# EAGLE schematic SWD (EAGLE 7.2.0)
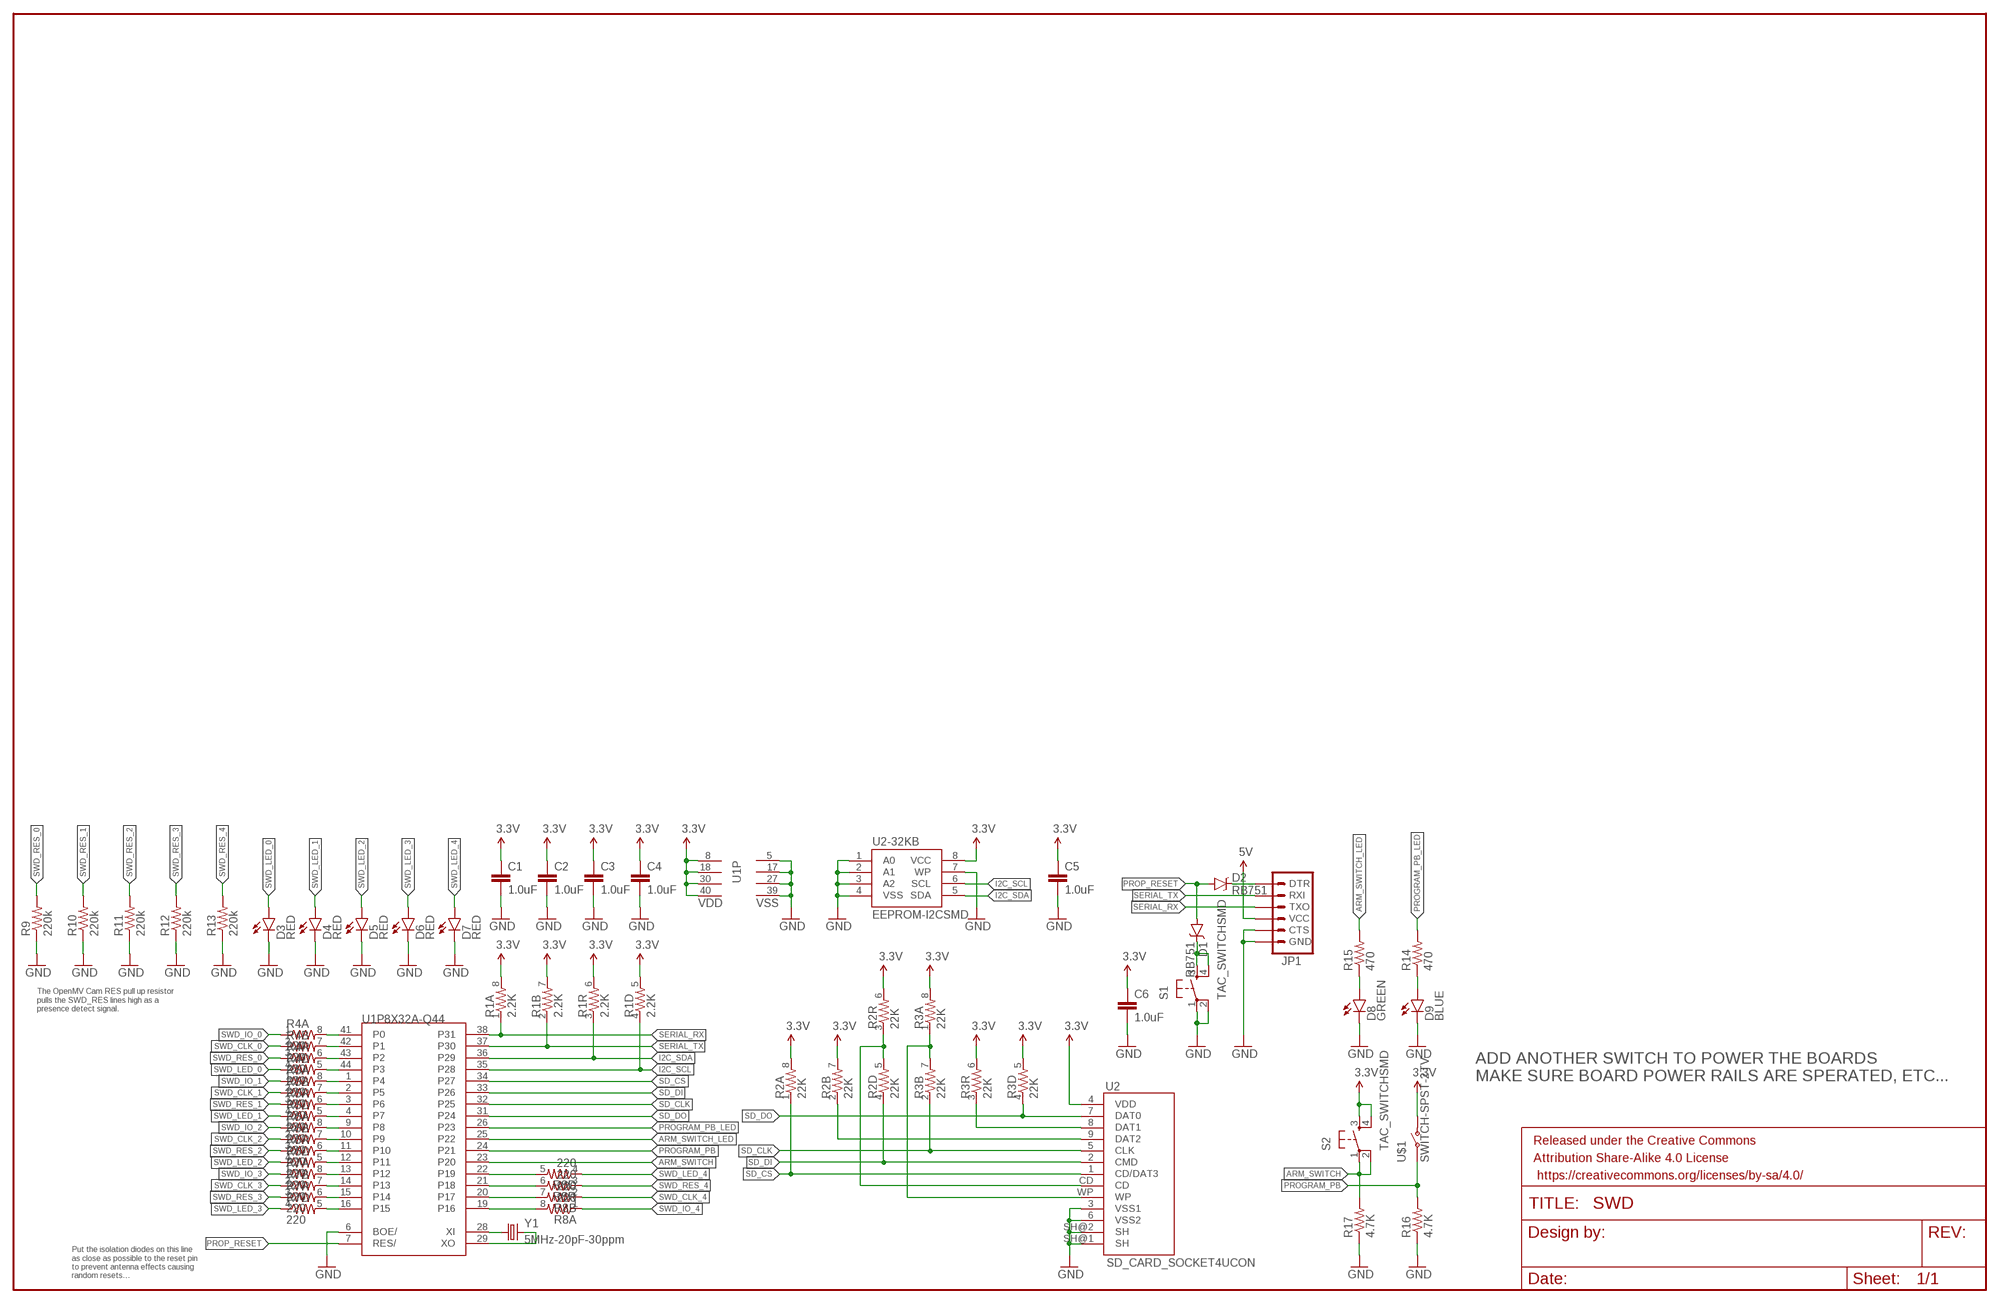
[diagram p0: schematic, sheet 1]

## Parts
C1  1.0uF  1.0UF-16V-10%(0402)  [0402-CAP]
C2  1.0uF  1.0UF-16V-10%(0402)  [0402-CAP]
C3  1.0uF  1.0UF-16V-10%(0402)  [0402-CAP]
C4  1.0uF  1.0UF-16V-10%(0402)  [0402-CAP]
C5  1.0uF  1.0UF-16V-10%(0402)  [0402-CAP]
C6  1.0uF  1.0UF-16V-10%(0402)  [0402-CAP]
D1  RB751  [SOD-523]
D2  RB751  [SOD-523]
D3  RED  LED-RED0603  [LED-0603]
D4  RED  LED-RED0603  [LED-0603]
D5  RED  LED-RED0603  [LED-0603]
D6  RED  LED-RED0603  [LED-0603]
D7  RED  LED-RED0603  [LED-0603]
D8  GREEN  LED-GREEN0603  [LED-0603]
D9  BLUE  LED-BLUE0603  [LED-0603]
FRAME1  FRAME-LEDGER  [CREATIVE_COMMONS]
JP1  ARDUINO_SERIAL_PROGRAMPTH  [1X06]
R1  2.2K  RESISTOR-ARRAY0603-ARV  [0603-ARV]
R2  22K  RESISTOR-ARRAY0603-ARV  [0603-ARV]
R3  22K  RESISTOR-ARRAY0603-ARV  [0603-ARV]
R4  220  RESISTOR-ARRAY0603-ARV  [0603-ARV]
R5  220  RESISTOR-ARRAY0603-ARV  [0603-ARV]
R6  220  RESISTOR-ARRAY0603-ARV  [0603-ARV]
R7  220  RESISTOR-ARRAY0603-ARV  [0603-ARV]
R8  220  RESISTOR-ARRAY0603-ARV  [0603-ARV]
R9  220k  220KOHM1/10W1%(0603)  [0603-RES]
R10  220k  220KOHM1/10W1%(0603)  [0603-RES]
R11  220k  220KOHM1/10W1%(0603)  [0603-RES]
R12  220k  220KOHM1/10W1%(0603)  [0603-RES]
R13  220k  220KOHM1/10W1%(0603)  [0603-RES]
R14  470  470OHM1/10W1%(0603)  [0603-RES]
R15  470  470OHM1/10W1%(0603)  [0603-RES]
R16  4.7K  4.7KOHM-1/10W-1%(0603)  [0603-RES]
R17  4.7K  4.7KOHM-1/10W-1%(0603)  [0603-RES]
S1  TAC_SWITCHSMD  [TACTILE-SWITCH-SMD]
S2  TAC_SWITCHSMD  [TACTILE-SWITCH-SMD]
U1  P8X32A-Q44  [P8X32A-Q44]
U2  SD_CARD_SOCKET4UCON  [SDCARD_4UCONN]
U2-32KB  EEPROM-I2CSMD  [SO08]
U$1  SWITCH-SPST-2TV  [SWITCH-SPST-VERTICAL]
Y1  5MHz-20pF-30ppm  CRYSTALSMD  [HC49UP]

## Nets
3.3V: C1.1 C2.1 C3.1 C4.1 C5.1 C6.1 R1.5 R1.6 R1.7 R1.8 R2.6 R2.7 R2.8 R3.5 R3.6 R3.8 S2.3 S2.4 U1.8(P:VDD) U1.18(P:VDD) U1.30(P:VDD) U1.40(P:VDD) U2-32KB.8(VCC) U2.4(VDD) U$1.1(O)
5V: JP1.4(VCC)
ARM_SWITCH: R17.2 S2.1 S2.2 U1.23(P8X32A-Q44:P20)
ARM_SWITCH_LED: R15.2 U1.25(P8X32A-Q44:P22)
GND: C1.2 C2.2 C3.2 C4.2 C5.2 C6.2 D3.C D4.C D5.C D6.C D7.C D8.C D9.C JP1.5(CTS) JP1.6(GND) R9.1 R10.1 R11.1 R12.1 R13.1 R16.1 R17.1 S1.1 S1.2 U1.5(P:VSS) U1.6(P8X32A-Q44:BOE/) U1.17(P:VSS) U1.27(P:VSS) U1.39(P:VSS) U2-32KB.1(A0) U2-32KB.2(A1) U2-32KB.3(A2) U2-32KB.4(VSS) U2-32KB.7(WP) U2.3(VSS1) U2.6(VSS2) U2.SH@1(SH) U2.SH@2(SH)
I2C_SCL: R1.4 U1.35(P8X32A-Q44:P28) U2-32KB.6(SCL)
I2C_SDA: R1.3 U1.36(P8X32A-Q44:P29) U2-32KB.5(SDA)
N$1: R4.8 U1.41(P8X32A-Q44:P0)
N$2: R4.7 U1.42(P8X32A-Q44:P1)
N$3: U1.28(P8X32A-Q44:XI) Y1.1
N$4: U1.29(P8X32A-Q44:XO) Y1.2
N$5: D8.A R15.1
N$6: R4.6 U1.43(P8X32A-Q44:P2)
N$7: R4.5 U1.44(P8X32A-Q44:P3)
N$8: D1.C S1.3 S1.4
N$9: R5.8 U1.1(P8X32A-Q44:P4)
N$10: R5.7 U1.2(P8X32A-Q44:P5)
N$11: R5.6 U1.3(P8X32A-Q44:P6)
N$12: R5.5 U1.4(P8X32A-Q44:P7)
N$13: R6.8 U1.9(P8X32A-Q44:P8)
N$14: R3.1 R3.7 U2.WP
N$15: R6.7 U1.10(P8X32A-Q44:P9)
N$16: R2.3 R2.5 U2.CD
N$17: R6.6 U1.11(P8X32A-Q44:P10)
N$18: R6.5 U1.12(P8X32A-Q44:P11)
N$19: R7.8 U1.13(P8X32A-Q44:P12)
N$20: R7.7 U1.14(P8X32A-Q44:P13)
N$21: R7.6 U1.15(P8X32A-Q44:P14)
N$22: R7.5 U1.16(P8X32A-Q44:P15)
N$23: R8.5 U1.22(P8X32A-Q44:P19)
N$24: R8.6 U1.21(P8X32A-Q44:P18)
N$25: R8.7 U1.20(P8X32A-Q44:P17)
N$26: R8.8 U1.19(P8X32A-Q44:P16)
N$27: D2.C JP1.1(DTR)
N$28: D9.A R14.1
PROGRAM_PB: R16.2 U1.24(P8X32A-Q44:P21) U$1.2(P)
PROGRAM_PB_LED: R14.2 U1.26(P8X32A-Q44:P23)
PROP_RESET: D1.A D2.A U1.7(P8X32A-Q44:RES/)
SD_CLK: R3.2 U1.32(P8X32A-Q44:P25) U2.5(CLK)
SD_CS: R2.1 R3.3 U1.34(P8X32A-Q44:P27) U2.1(CD/DAT3) U2.8(DAT1)
SD_DI: R2.4 U1.33(P8X32A-Q44:P26) U2.2(CMD)
SD_DO: R2.2 R3.4 U1.31(P8X32A-Q44:P24) U2.7(DAT0) U2.9(DAT2)
SERIAL_RX: JP1.3(TXO) R1.1 U1.38(P8X32A-Q44:P31)
SERIAL_TX: JP1.2(RXI) R1.2 U1.37(P8X32A-Q44:P30)
SWD_CLK_0: R4.2
SWD_CLK_1: R5.2
SWD_CLK_2: R6.2
SWD_CLK_3: R7.2
SWD_CLK_4: R8.2
SWD_IO_0: R4.1
SWD_IO_1: R5.1
SWD_IO_2: R6.1
SWD_IO_3: R7.1
SWD_IO_4: R8.1
SWD_LED_0: D3.A R4.4
SWD_LED_1: D4.A R5.4
SWD_LED_2: D5.A R6.4
SWD_LED_3: D6.A R7.4
SWD_LED_4: D7.A R8.4
SWD_RES_0: R4.3 R9.2
SWD_RES_1: R5.3 R10.2
SWD_RES_2: R6.3 R11.2
SWD_RES_3: R7.3 R12.2
SWD_RES_4: R8.3 R13.2

## Notes on the sheet
- The OpenMV Cam RES pull up resistor
  pulls the SWD_RES lines high as a
  presence detect signal.
- ADD ANOTHER SWITCH TO POWER THE BOARDS
  MAKE SURE BOARD POWER RAILS ARE SPERATED, ETC...
- Put the isolation diodes on this line
  as close as possible to the reset pin
  to prevent antenna effects causing
  random resets...

## Library data of the parts
C1-C6 = SparkFun-Capacitors:1.0UF-16V-10%(0402); PROD_ID: CAP-12417
D1 D2 = SparkFun-DiscreteSemi:RB751: 40V 120mA SOD-523 Schottky DIO-11018; PROD_ID: DIO-11018
D3-D7 = SparkFun-LED:LED-RED: Assorted Red LEDs LilyPad 1206- DIO-09912 1206- DIO-00809 0603- DIO-00819; PROD_ID: DIO-00819
D8 = SparkFun-LED:LED-GREEN: Various green LEDs Green LEDs used in SFE Production 0603- DIO-00821 LARGE- DIO-00862 LILYPAD- DIO-09910; PROD_ID: DIO-00821
D9 = SparkFun-LED:LED-BLUE: Blue LEDs for production use Various blue LEDs stocked by SparkFun production 0603 - DIO-08575 Rebel - DIO-09553 1206 - DIO-09911; PROD_ID: DIO-08575
FRAME1 = SparkFun-Aesthetics:FRAME-LEDGER: Schematic Frame Standard 11x14 US Ledger frame
JP1 = SparkFun-Connectors:ARDUINO_SERIAL_PROGRAM: FTDI connector footprints
R1-R8 = SparkFun-Resistors:RESISTOR-ARRAY: Array Chip Resistor Source: RS Component / Phycomp
R9-R13 = SparkFun-Resistors:220KOHM1/10W1%(0603): RES-08969; PROD_ID: RES-08969
R14 R15 = SparkFun-Resistors:470OHM1/10W1%(0603): RES-07869; PROD_ID: RES-07869
R16 R17 = SparkFun-Resistors:4.7KOHM-1/10W-1%(0603): RES-07857; PROD_ID: RES-07857
S1 S2 = SparkFun-Retired:TAC_SWITCH: Momentary Switch Button commonly used for reset or general input. Spark Fun Electronics SKU : COM-00097 SMT- SWCH-08247; PROD_ID: SWCH-08247
U1 = SparkFun-DigitalIC:P8X32A-Q44: Propellor uC
U2 = SparkFun-Connectors:SD_CARD_SOCKET: SD Memory Card Connector, push-push normal type, CD enable, WP enable
U2-32KB = SparkFun-DigitalIC:EEPROM-I2C: I2C EEPROM chips, 24LC256 (and others)
U$1 = SparkFun-Electromechanical:SWITCH-SPST-2
Y1 = SparkFun-FreqCtrl:CRYSTAL: Various standard crystals. Proven footprints.